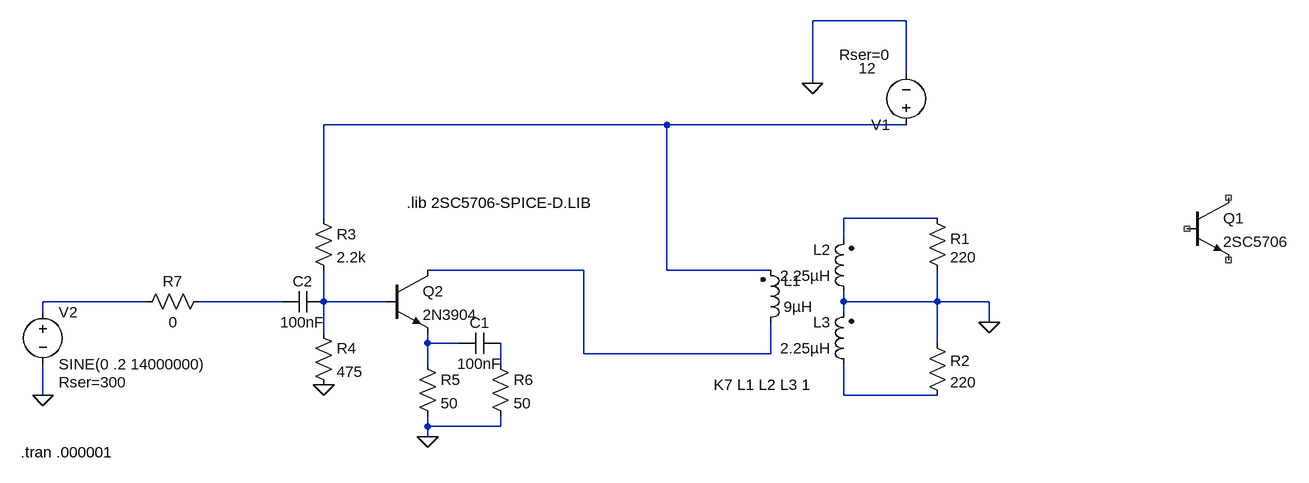
[diagram p0: schematic 2sc5706.asc]
2sc5706.asc, the LTspice schematic file:
Version 4
SHEET 1 1476 680
WIRE 816 -208 672 -208
WIRE 816 -128 816 -208
WIRE 672 -112 672 -208
WIRE 448 -48 -80 -48
WIRE 816 -48 448 -48
WIRE -80 96 -80 -48
WIRE 864 96 720 96
WIRE 720 128 720 96
WIRE 320 176 80 176
WIRE 448 176 448 -48
WIRE 608 176 448 176
WIRE -352 224 -512 224
WIRE -144 224 -272 224
WIRE -80 224 -80 176
WIRE 16 224 -80 224
WIRE 720 224 720 208
WIRE 864 224 864 176
WIRE 864 224 720 224
WIRE 944 224 864 224
WIRE -512 240 -512 224
WIRE 720 240 720 224
WIRE 944 256 944 224
WIRE -80 272 -80 224
WIRE 80 288 80 272
WIRE 128 288 80 288
WIRE 864 288 864 224
WIRE 320 304 320 176
WIRE 608 304 608 256
WIRE 608 304 320 304
WIRE 80 320 80 288
WIRE 192 320 192 288
WIRE -512 368 -512 320
WIRE 720 368 720 320
WIRE 864 368 720 368
WIRE 80 416 80 400
WIRE 192 416 192 400
WIRE 192 416 80 416
WIRE 80 432 80 416
FLAG -80 352 0
FLAG 80 432 0
FLAG 672 -112 0
FLAG -512 368 0
FLAG 944 256 0
SYMBOL ind2 592 272 M180
WINDOW 0 36 80 Left 2
WINDOW 3 36 40 Left 2
SYMATTR InstName L1
SYMATTR Value 9µH
SYMATTR Type ind
SYMBOL ind2 736 224 R180
WINDOW 0 36 80 Left 2
WINDOW 3 36 40 Left 2
SYMATTR InstName L2
SYMATTR Value 2.25µH
SYMATTR Type ind
SYMBOL ind2 736 336 R180
WINDOW 0 36 80 Left 2
WINDOW 3 36 40 Left 2
SYMATTR InstName L3
SYMATTR Value 2.25µH
SYMATTR Type ind
SYMBOL res 848 80 R0
WINDOW 0 36 47 Left 2
SYMATTR InstName R1
SYMATTR Value 220
SYMBOL res 848 272 R0
WINDOW 0 36 43 Left 2
SYMATTR InstName R2
SYMATTR Value 220
SYMBOL res -96 80 R0
SYMATTR InstName R3
SYMATTR Value 2.2k
SYMBOL res -96 256 R0
SYMATTR InstName R4
SYMATTR Value 475
SYMBOL res 64 304 R0
SYMATTR InstName R5
SYMATTR Value 50
SYMBOL cap 192 272 R90
WINDOW 0 0 32 VBottom 2
WINDOW 3 32 32 VTop 2
SYMATTR InstName C1
SYMATTR Value 100nF
SYMBOL res 176 304 R0
SYMATTR InstName R6
SYMATTR Value 50
SYMBOL npn 1248 64 R0
SYMATTR InstName Q1
SYMATTR Value 2SC5706
SYMBOL voltage 816 -32 R180
WINDOW 123 0 0 Left 0
WINDOW 39 24 124 Left 2
WINDOW 3 46 103 Left 2
SYMATTR SpiceLine Rser=0
SYMATTR Value 12
SYMATTR InstName V1
SYMBOL voltage -512 224 R0
WINDOW 123 0 0 Left 0
WINDOW 39 24 124 Left 2
SYMATTR SpiceLine Rser=300
SYMATTR InstName V2
SYMATTR Value SINE(0 .2 14000000)
SYMBOL cap -80 208 R90
WINDOW 0 0 32 VBottom 2
WINDOW 3 32 32 VTop 2
SYMATTR InstName C2
SYMATTR Value 100nF
SYMBOL res -256 208 R90
WINDOW 0 0 56 VBottom 2
WINDOW 3 32 56 VTop 2
SYMATTR InstName R7
SYMATTR Value 0
SYMBOL npn 16 176 R0
SYMATTR InstName Q2
SYMATTR Value 2N3904
TEXT 520 352 Left 2 !K7 L1 L2 L3 1
TEXT -546 456 Left 2 !.tran .000001
TEXT 48 72 Left 2 !.lib 2SC5706-SPICE-D.LIB

The netlist it stands for:
* 2sc5706.asc
L1 N003 N001 9µH
L2 0 N002 2.25µH
L3 N009 0 2.25µH
R1 N002 0 220
R2 0 N009 220
R3 N001 N006 2.2k
R4 N006 0 475
R5 N007 0 50
C1 N008 N007 100nF
R6 N008 0 50
Q1 NC_01 NC_02 NC_03 0 2SC5706
V1 N001 0 12 Rser=0
V2 N004 0 SINE(0 .2 14000000) Rser=300
C2 N006 N005 100nF
R7 N005 N004 0
Q2 N003 N006 N007 0 2N3904
.model NPN NPN
.model PNP PNP
.lib standard.bjt
K7 L1 L2 L3 1
.tran .000001
.lib 2SC5706-SPICE-D.LIB
.backanno
.end